# EAGLE design Astabile_Base (EAGLE 7.2.0)
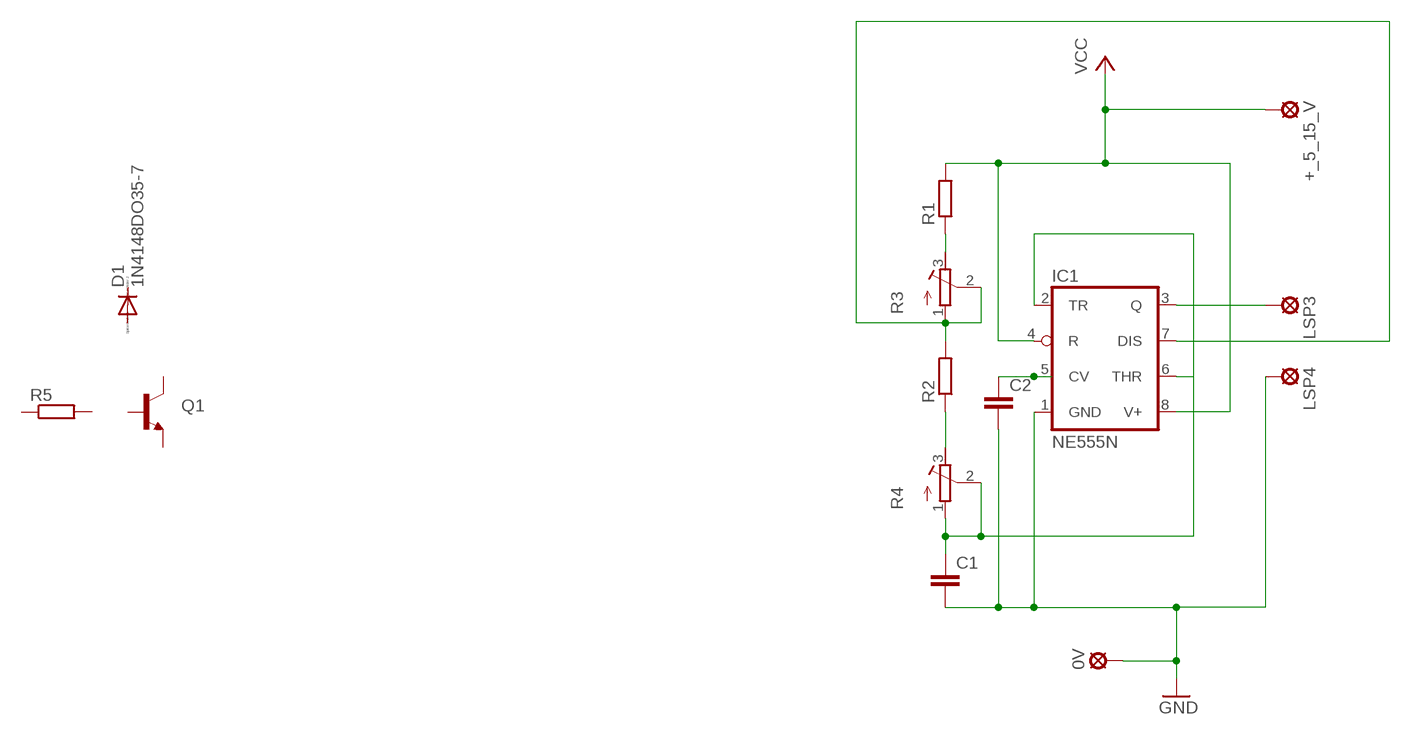
[diagram p0: schematic, sheet 1]

## Parts
0V  LSP10  [LSP10]
+_5_15_V  LSP10  [LSP10]
C1  C-EU050-024X044  [C050-024X044]
C2  C-EU050-024X044  [C050-024X044]
D1  1N4148DO35-7  [DO35-7]
IC1  NE555N  [DIL08]
LSP3  LSP10  [LSP10]
LSP4  LSP10  [LSP10]
Q1  TRANSISTOR_NPNBC547  [TO-92-AMMO]
R1  R-EU_0204/7  [0204/7]
R2  R-EU_0204/7  [0204/7]
R3  R-TRIMM3339P  [RTRIM3339P]
R4  R-TRIMM3339P  [RTRIM3339P]
R5  R-EU_0207/2V  [0207/2V]

## Nets
GND: 0V.MP C1.2 C2.2 IC1.1(GND) LSP4.MP
N$1: IC1.3(Q) LSP3.MP
N$2: R1.1 R3.3(E)
N$3: IC1.7(DIS) R2.2 R3.1(A) R3.2(S)
N$4: R2.1 R4.3(E)
N$5: C1.1 IC1.2(TR) IC1.6(THR) R4.1(A) R4.2(S)
N$8: C2.1 IC1.5(CV)
VCC: +_5_15_V.MP IC1.4(R) IC1.8(V+) R1.2
Unconnected: D1.A D1.C Q1.1(C) Q1.2(B) Q1.3(E) R5.1 R5.2

## Library data of the parts
0V +_5_15_V LSP3 LSP4 = solpad:LSP10: SOLDER PAD drill 1.0 mm, distributor Buerklin, 12H555
C1 C2 = resistor:C-EU: CAPACITOR, European symbol
D1 = diode:1N4148: DIODE high speed (Philips)
IC1 = linear:*555: TIMER
Q1 = SparkFun-DiscreteSemi:TRANSISTOR_NPN: Generic NPN BJT MMBT2222A - TRANS-08049 (SOT-23, 1A 40V) MPSA42 - TRANS-09116 (SOT-23, 500mA 300V) MMBT5088LT1G - TRANS-11160 (SOT-23, 50 mA 30V) BC547 - COM-08928 <http://www.sparkfun.com/products/8928> (TO-92 45V 100mA) (1.Collector 2.Base 3.Emitter) 2N3904 - COM-00521 <http://www.sparkfun.com/products/521> (TO-92 40V 200mA) (1.Emitter 2.Base 3.Collector) P2N2222A - COM-12852 <http://www.sparkfun.com/products/12852> (TO-92 40V 600mA) (1.Collector 2.Base 3.Emitter)
R1 R2 R5 = resistor:R-EU_: RESISTOR, European symbol
R3 R4 = resistor:R-TRIMM: Trimm resistor

## Board
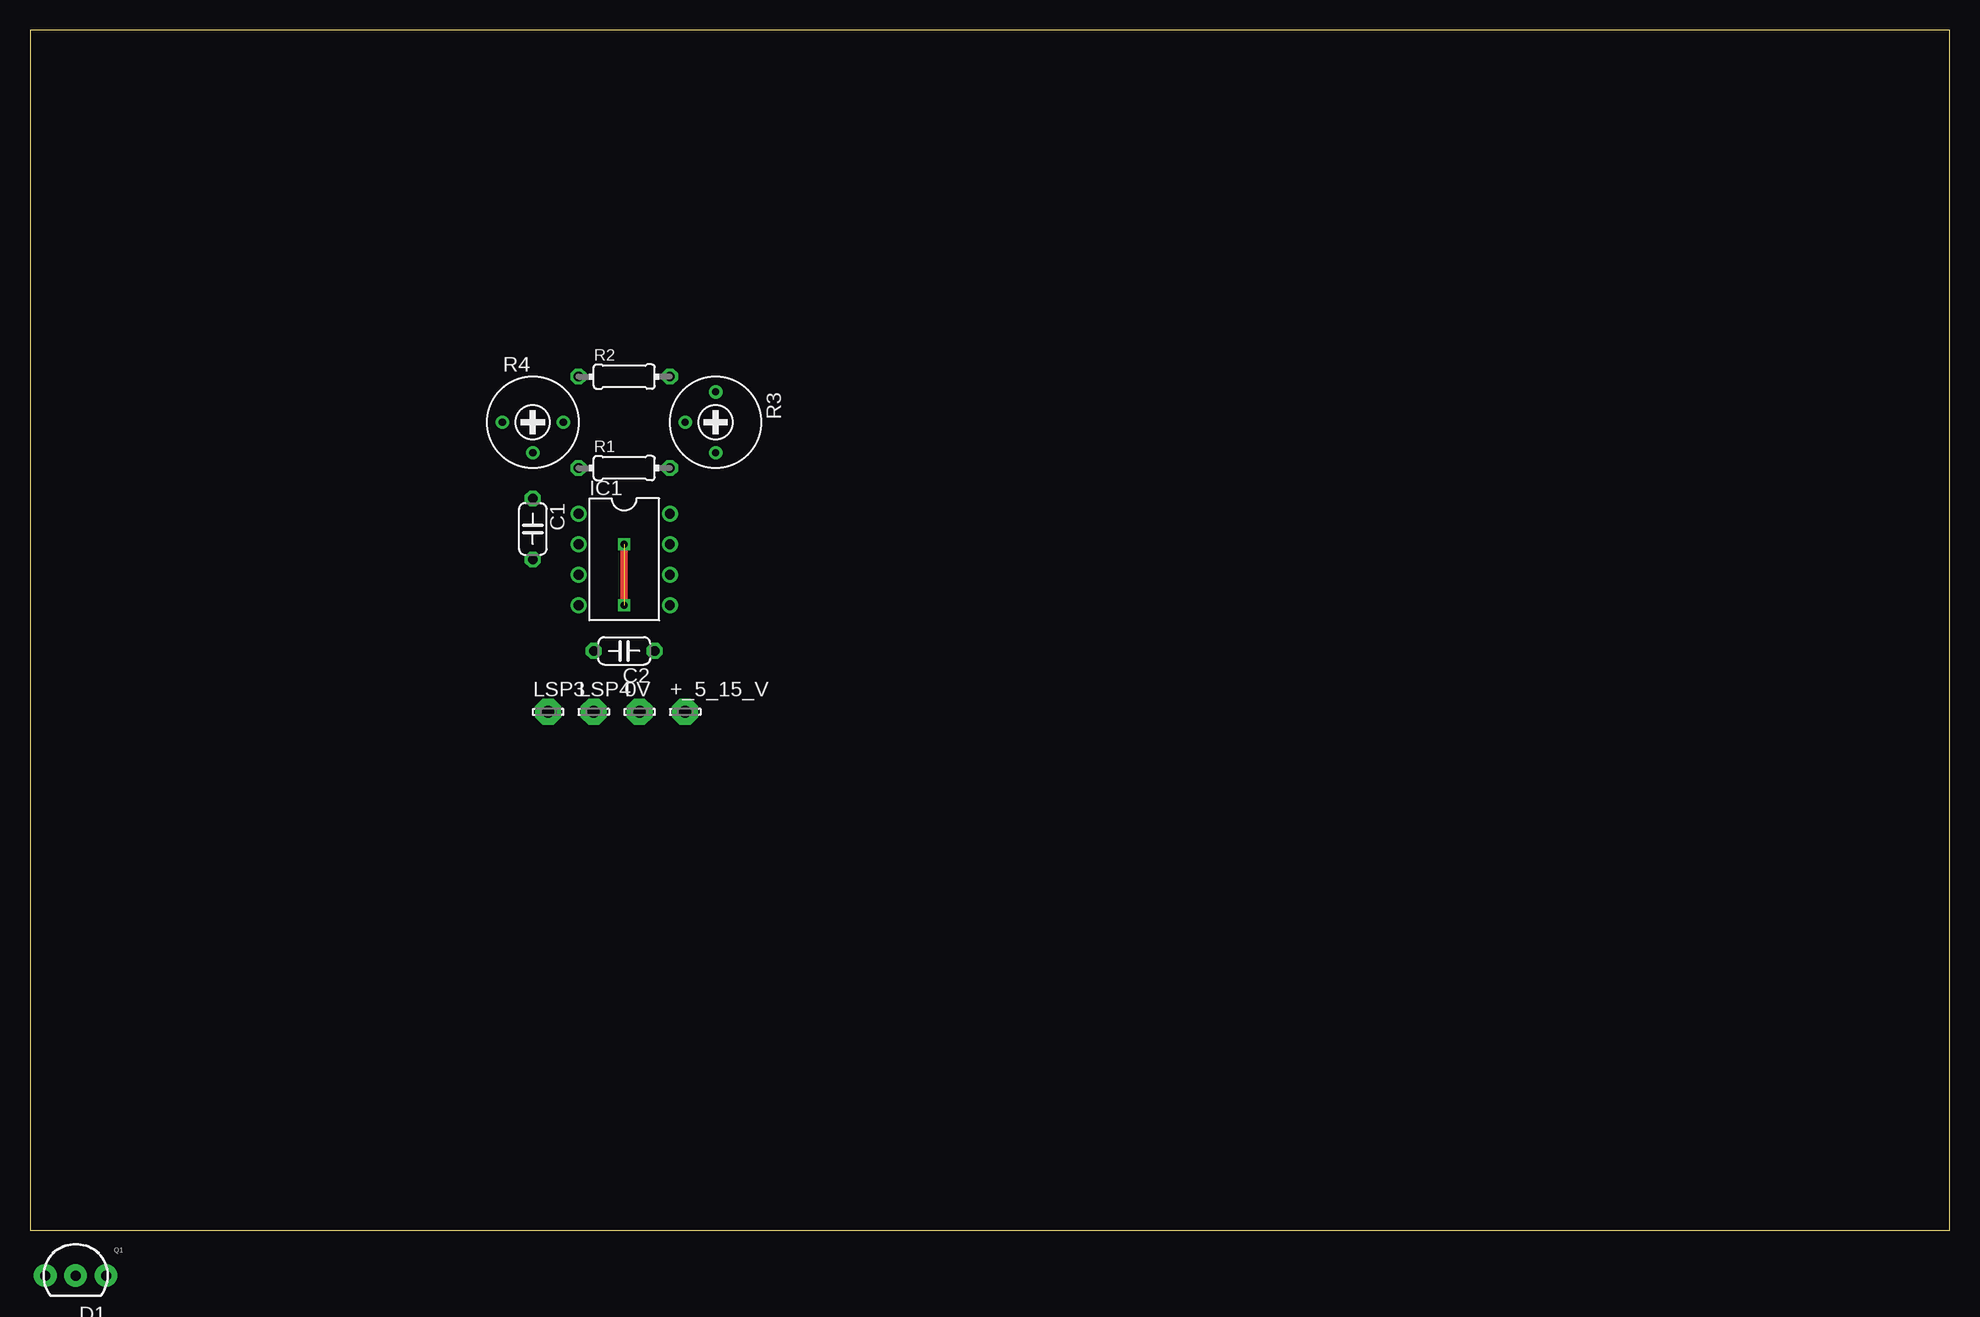
[diagram p1: board, top side]
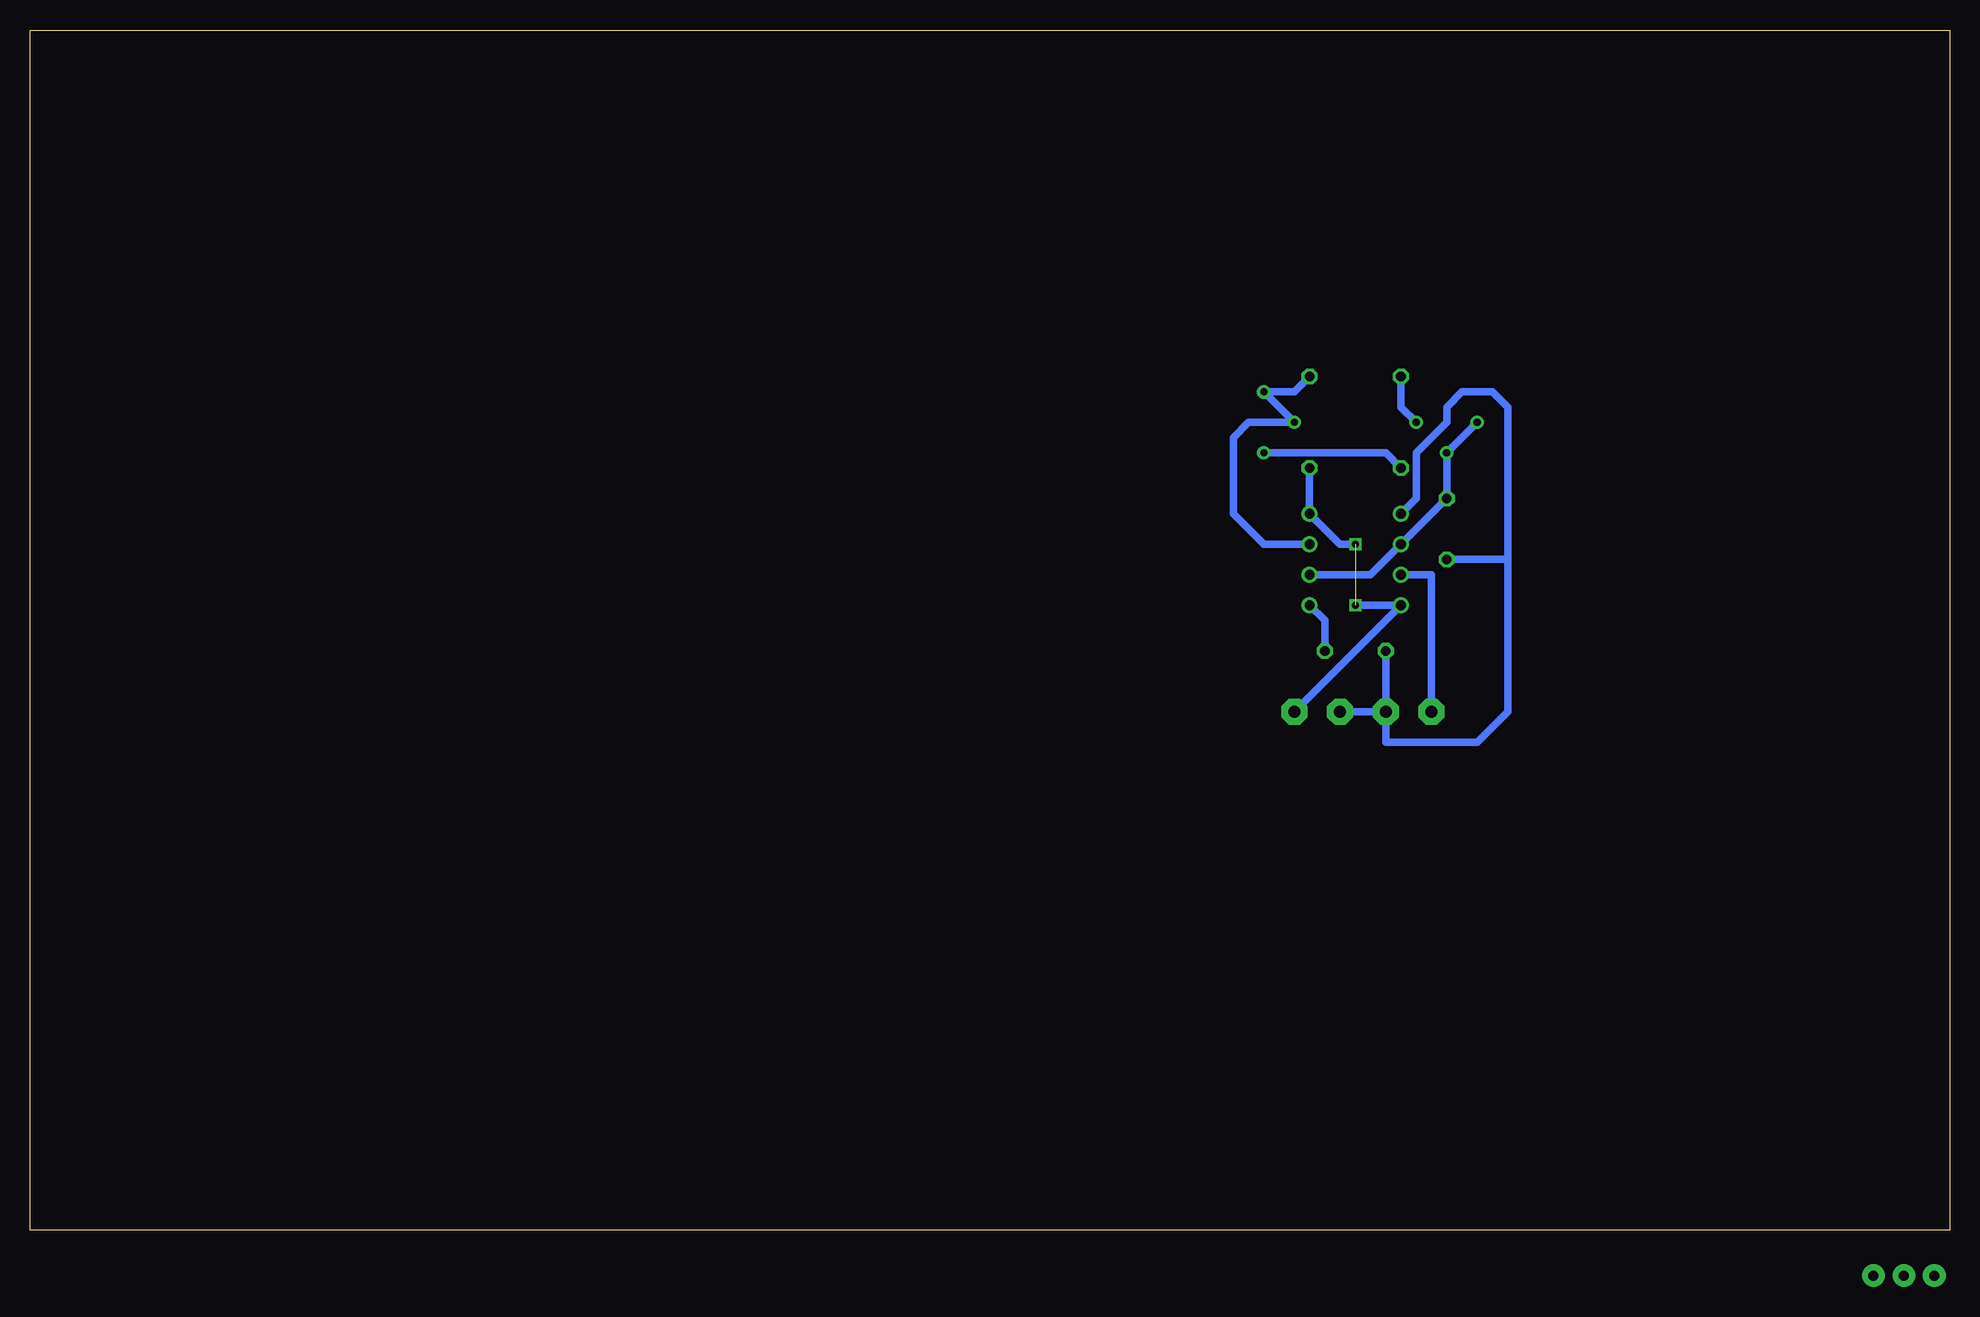
[diagram p2: board, bottom side, seen from below]

Size 160 x 100 mm. Coordinates in mm from the lower left corner, seen from the top.
Outline: 0,0 160,0 160,100 0,100 0,0
Copper layers (1*16): Top 0.035mm / dielectric 1.5mm / Bottom 0.035mm
Design rules "default": minimum track width 10mil, minimum drill 24mil, track to track 8mil, track to pad 8mil, pad to pad 8mil, via to via 8mil, smd to smd 8mil, copper to edge 40mil, drill to drill 8mil, minimum pad ring 10mil, minimum via ring 8mil, stop-mask expansion 4mil, vias tented up to drill 0mil, thermal gap 10mil

### Footprints (pad centres in the part's own frame; a part is rotated, then mirrored left to right if it is on the bottom)
LSP10 = drill 1.016 pad 2.159 octagon: MP 0,0
C050-024X044 = drill 0.813 octagon: 1 -2.54,0; 2 2.54,0
DO35-7 = drill 0.813 long: A 3.81,0; C -3.81,0
DIL08 = drill 0.813 pad 1.27: 1 -3.81,-3.81; 2 -1.27,-3.81; 3 1.27,-3.81; 4 3.81,-3.81; 5 3.81,3.81; 6 1.27,3.81; 7 -1.27,3.81; 8 -3.81,3.81
TO-92-AMMO = drill 0.813 pad 1.88: 1 -2.54,0; 2 0,0; 3 2.54,0
0204/7 = drill 0.813 octagon: 1 -3.81,0; 2 3.81,0
RTRIM3339P = drill 0.61: 1 -2.54,0; 2 0,-2.54; 3 2.54,0
0207/2V = drill 0.813 octagon: 1 -1.27,0; 2 1.27,0

### Placement (x,y rotation side)
0V  50.8,43.18 0 top
+_5_15_V  54.61,43.18 0 top
C1  41.91,58.42 270 top
C2  49.53,48.26 180 top
D1  6.35,-8.89 0 top  (outside the outline)
IC1  49.53,55.88 270 top
LSP3  43.18,43.18 0 top
LSP4  46.99,43.18 0 top
Q1  3.81,-3.81 0 top  (outside the outline)
R1  49.53,63.5 0 top
R2  49.53,71.12 0 top
R3  57.15,67.31 270 top
R4  41.91,67.31 0 top
R5  3.81,-15.24 0 top  (outside the outline)

### Tracks (layer width: path | path; a pad name or v marks a point on that pad's centre or on a via)
GND
  Bottom 0.61: IC1.1 44.45,60.96 44.45,64.77 41.91,67.31 41.91,68.58 40.64,69.85 38.1,69.85 36.83,68.58 36.83,55.88 | C1.2 36.83,55.88 | 36.83,55.88 36.83,43.18 39.37,40.64 46.99,40.64 LSP4.MP | 0V.MP LSP4.MP | C2.2 LSP4.MP
N$1
  Bottom 0.61: IC1.3 43.18,54.61 LSP3.MP
N$2
  Bottom 0.61: R1.1 46.99,64.77 R3.3
N$3
  Bottom 0.61: R2.2 54.61,69.85 R3.1 R3.2 58.42,67.31 59.69,66.04 59.69,59.69 57.15,57.15 IC1.7
N$4
  Bottom 0.61: R4.3 45.72,68.58 R2.1
N$5
  Bottom 0.61: R4.1 R4.2 C1.1 IC1.2 48.26,54.61 IC1.6
N$8
  Bottom 0.61: IC1.5 52.07,50.8 C2.1
VCC  (via drill 0.6)  (1 unrouted)
  Top 0.61: v49.53,57.15 v49.53,52.07
  Bottom 0.61: R1.2 IC1.8 50.8,57.15 v49.53,57.15 | +_5_15_V.MP IC1.4 v49.53,52.07